# Altium schematic sheet LUCRARE_LICENTA.SchDoc
size A3; SheetNumber: 1; SheetTotal: 1
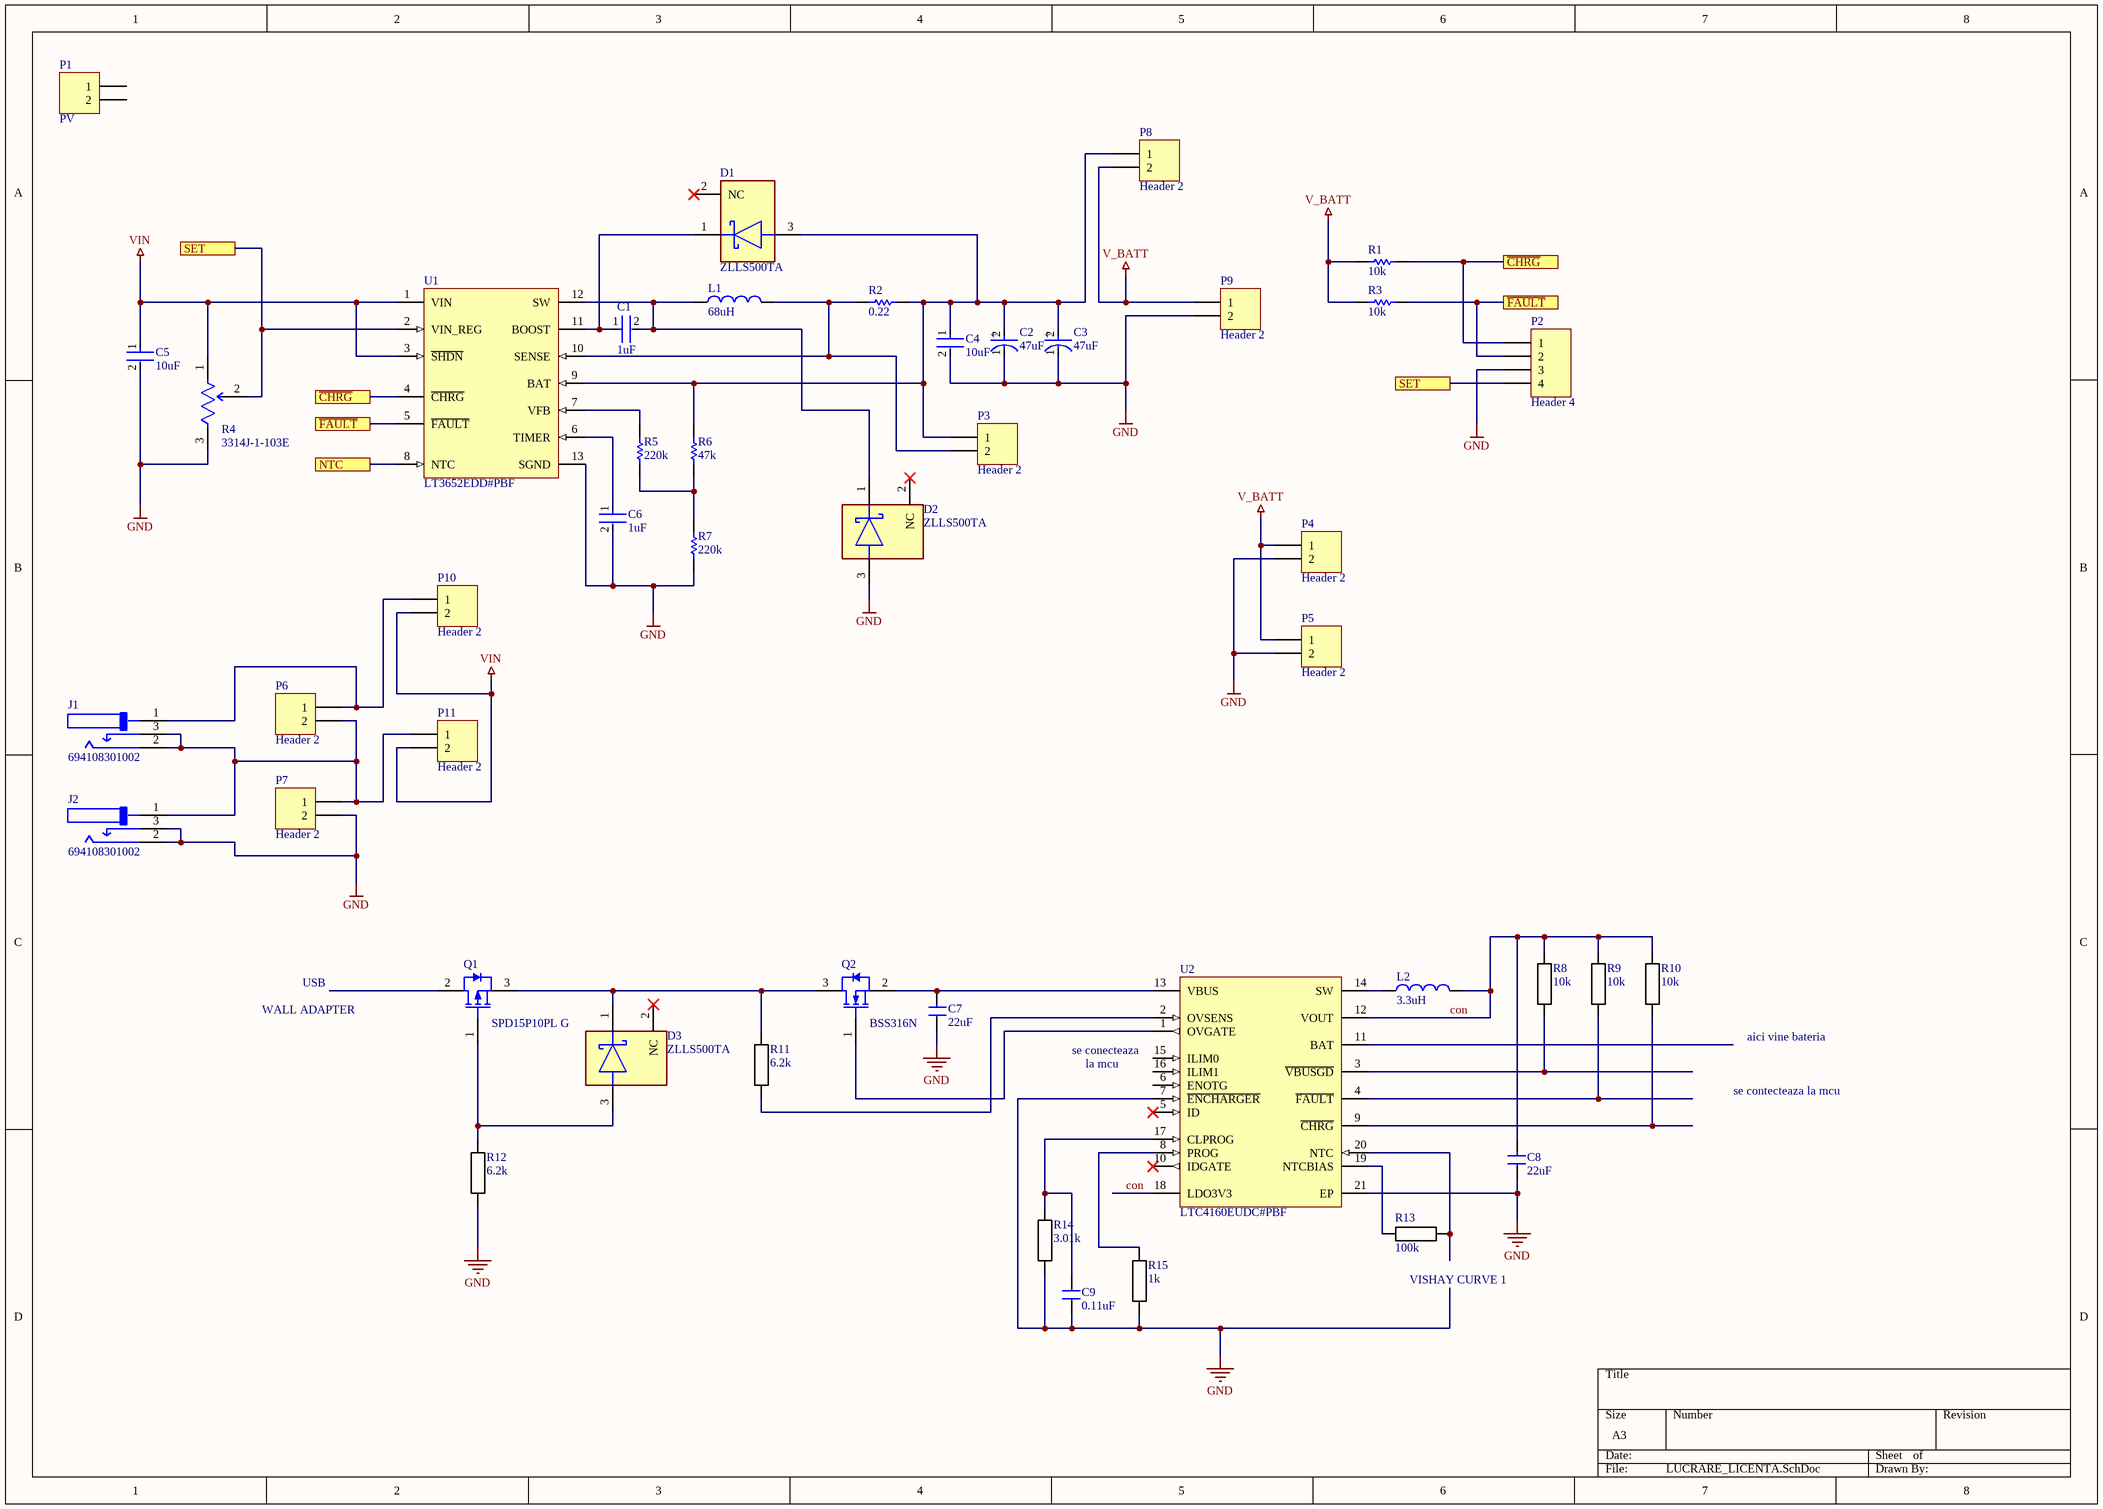
[diagram p0: LUCRARE_LICENTA.SchDoc]

## Parts
C1  1uF  [FP-0603-L_1_6_0_15-W_0_8-IPC_C]
C2  47uF  [FP-T491A476M006AT-MFG]
C3  47uF  [FP-T491A476M006AT-MFG]
C4  10uF  [FP-0603-L_1_6_0_15-W_0_8-MFG]
C5  10uF  [FP-0603-L_1_6_0_15-W_0_8-MFG]
C6  1uF  [FP-0603-L_1_6_0_15-W_0_8-IPC_C]
C7  22uF
C8  22uF
C9  0.11uF
D1  ZLLS500TA  [FP-SOT23-IPC_B]
D2  ZLLS500TA  [FP-SOT23-IPC_B]
D3  ZLLS500TA  [FP-SOT23-IPC_B]
J1  694108301002  [FP-694108301002-MFG]
J2  694108301002  [FP-694108301002-MFG]
L1  68uH
L2  3.3uH
P1  PV  [HDR1X2]
P2  Header 4  [HDR1X4]
P3  Header 2  [HDR1X2]
P4  Header 2  [HDR1X2]
P5  Header 2  [HDR1X2]
P6  Header 2  [HDR1X2]
P7  Header 2  [HDR1X2]
P8  Header 2  [HDR1X2]
P9  Header 2  [HDR1X2]
P10  Header 2  [HDR1X2]
P11  Header 2  [HDR1X2]
Q1  SPD15P10PL G  [INF-PG-TO252-3-1_N]
Q2  BSS316N  [INF-PG-SOT23_L]
R1  10k  [RESC1609X55X30LL15T15]
R2  0.22  [RESC1608X55X30NL15T15]
R3  10k  [RESC1609X55X30LL15T15]
R4  3314J-1-103E  [FP-3314J-1-MFG]
R5  220k  [RESC1608X55X25ML10T15]
R6  47k  [RESC1608X55X30NL15T15]
R7  220k  [RESC1608X55X25ML10T15]
R8  10k
R9  10k
R10  10k
R11  6.2k
R12  6.2k
R13  100k
R14  3.01k
R15  1k
U1  LT3652EDD#PBF  [LT-DD-12_V]
U2  LTC4160EUDC#PBF  [LT-UDC-20_N]

## Ports
NTC, SET, ~{CHRG}, ~{FAULT}

## Nets
GND: C2.1(C) C3.1(C) C4.2 C5.2 C6.2 C7.2 C8.1 C9.1 D2.3(A) J2.2 J2.3 P2.3 P4.2 P5.2 P7.2 P9.2 R4.3(CW) R7.1 R12.20 R14.20 R15.20 U1.13(SGND) U2.7(~{ENCHARGER}) U2.21(EP)
V_BATT: P4.1 P5.1 P8.2 P9.1 R1.1 R3.1
VIN: C5.1 P10.2 P11.2 R4.1(CCW) U1.1(VIN) U1.3(~{SHDN})
~{CHRG}: P2.1 R1.2 U1.4(~{CHRG}) ; port ~{CHRG}
con: C8.2 L2.2 R8.21 R9.21 R10.21 U2.12(VOUT) U2.18(LDO3V3)
~{FAULT}: P2.2 R3.2 U1.5(~{FAULT}) ; port ~{FAULT}
NTC: U1.8(NTC) ; port NTC
SET: P2.4 R4.2(WIPER) U1.2(VIN_REG) ; port SET
NetC1_1: C1.1 D1.1(C) U1.11(BOOST)
NetC1_2: C1.2 D2.1(C) L1.1 U1.12(SW)
NetC2_2: C2.2(A) C3.2(A) C4.1 D1.3(A) P3.1 P8.1 R2.2 R6.2 U1.9(BAT)
NetC6_1: C6.1 U1.6(TIMER)
NetC7_1: C7.1 Q2.2(SOURCE) U2.13(VBUS)
NetC9_2: C9.2 R14.21 U2.17(CLPROG)
NetD3_1: D3.1(C) Q1.3(SOURCE) Q2.3(DRAIN) R11.21
NetD3_3: D3.3(A) Q1.1(GATE) R12.21
NetJ1_1: J1.1 P6.1 P10.1
NetJ1_2: J1.2 J1.3 J2.1 P6.2 P7.1 P11.1
NetL1_2: L1.2 P3.2 R2.1 U1.10(SENSE)
NetL2_1: L2.1 U2.14(SW)
NetQ2_1: Q2.1(GATE) U2.1(OVGATE)
NetR5_1: R5.1 R6.1 R7.2
NetR5_2: R5.2 U1.7(VFB)
NetR8_20: R8.20 U2.3(~{VBUSGD})
NetR9_20: R9.20 U2.4(~{FAULT})
NetR10_20: R10.20 U2.9(~{CHRG})
NetR11_20: R11.20 U2.2(OVSENS)
NetR13_20: R13.20 U2.20(NTC)
NetR13_21: R13.21 U2.19(NTCBIAS)
NetR15_21: R15.21 U2.8(PROG)

Not connected (* = marked no-connect by the designer): D1 2(NC)*; D2 2(NC)*; D3 2(NC)*; P1 1 2; Q1 2(DRAIN); U2 5(ID)* 6(ENOTG) 10(IDGATE)* 11(BAT) 15(ILIM0) 16(ILIM1)

## Notes on the sheet
- USB
- WALL ADAPTER
- (near U2) se conecteaza
- aici vine bateria
- la mcu
- se contecteaza la mcu
- (near R13) VISHAY CURVE 1
- (in symbol CMP-2000-07189-2) +

## Library data of the parts
C1 C6 = CMP-2000-07531-4: Ceramic Capacitor General Use 1uF ±10% 50V X7R 0603; Series: M; Width: 0.031inch; Mount: Surface Mount; Radiation Hardening: No; Voltage Rating (DC): 50V; Packaging: Tape and Reel; Termination: SMD/SMT; Depth: 0.8mm; Case Code (Metric): 1608; Case Code (Imperial): 0603; Height: 0.8mm; Voltage Rating: 50V; Package Quantity: 1; Halogen Free: Halogen Free; Dielectric: X7R; Min Operating Temperature: -55°C; Length: 1.6mm; Construction: Flat; Tolerance: 10%; Thickness: 0.037inch; Max Operating Temperature: 125°C; Case/Package: 0603; Capacitance: 1uF; RoHS Compliant: Yes
C2 C3 = CMP-2000-07189-2: CAP TANT 47UF 20% 6.3V 1206; Voltage Rating (DC): 6V; ESR (Equivalent Series Resistance): 3.5R; Ripple Current: 146mA; Dissipation Factor: 12%; Dielectric Material: Tantalum; Life (Hours): 2000Hour; Leakage Current: 3uA; Polarity: Polar; Height - Seated (Max): 0.071inch; Case Code (Metric): 3216; Depth: 1.6mm; Case/Package: 1206; Termination: SMD/SMT; Number of Pins: 2; Max Operating Temperature: 125°C; Lead Free: Lead Free; Package Quantity: 1; Radiation Hardening: No; REACH SVHC: No SVHC; Features: General Purpose; Voltage: 6.3V; Width: 1.6mm; Mount: Surface Mount; Voltage Rating: 6.3V; Construction: Flat; Capacitance: 47uF; Height: 1.6mm; Tolerance: 20%; Series: T491; Length: 3.2mm; RoHS Compliant: Yes; Packaging: Tape and Reel; Case Code (Imperial): 1206; Min Operating Temperature: -55°C
C4 C5 = CMP-14477-000812-2: None; Tolerance: 20%; Voltage: 6.3V; Dielectric: X5R; Height: 0.8mm; Capacitance: 10uF; Depth: 0.8mm; Max Operating Temperature: 85°C; Packaging: Tape and Reel; Length: 1.6mm; Voltage Rating: 6.3V; Mount: Surface Mount; Case/Package: 0603; Termination: Wraparound; Min Operating Temperature: -55°C; Width: 0.031inch; RoHS Compliant: Yes; Thickness: 0.037inch
C7 C8 = CAP 22uF
C9 = CAP 0.1uF
D1-D3 = CMP-12790-000060-1: DIODE SCHOTTKY 40V 700MA SOT23-3; Max Forward Surge Current (Ifsm): 3.2A; Polarity: Standard; Peak Reverse Current: 10uA; Forward Voltage: 800mV; Peak Non-Repetitive Surge Current: 13A; Capacitance: 16pF; Power Dissipation: 500mW; Element Configuration: Single; Reverse Recovery Time: 3ns; Max Reverse Voltage (DC): 40V; Min Operating Temperature: -55°C; Height: 1mm; Termination: SMD/SMT; Forward Current: 700mA; Current Rating: 700mA; Max Operating Temperature: 150°C; Case/Package: SOT-23; Output Current: 700mA; Lead Free: Lead Free; Radiation Hardening: No; Mount: Surface Mount; Weight: 0.000282oz; Package Quantity: 3000; Width: 1.4mm; Packaging: Tape and Reel; Length: 3.05mm; Average Rectified Current: 700mA; Number of Pins: 3; Max Repetitive Reverse Voltage (Vrrm): 40V; Voltage Rating (DC): 40V
J1 J2 = CMP-1502-00190-2: CONN PWR JACK 2.5X5.5MM SOLDER; Pin Diameter: 2.5mm; Body Color: Black; Gender: Male; Voltage Rating (DC): 20V; Connector Type: Power; Current Rating: 5A; Shielding: Unshielded; Voltage Rating: 24V; Insulation Resistance: 100MR; RoHS Compliant: Yes; Packaging: Bulk; Mount: Through Hole; Max Operating Temperature: 85°C; Series: WR-DC; Contact Gender: Female; Termination: Through Hole; Flammability Rating: UL94 V-0; Package Quantity: 500; Color: Black; Contact Plating: Tin; Housing Material: Polyamide; Min Operating Temperature: -40°C; Contact Material: Copper Alloy
L1 = INDUCTOR 68uH
L2 = INDUCTOR 3.3uH
P1 P3-P11 = Header 2: Header, 2-Pin; LatestRevisionDate: 17-Jul-2002; LatestRevisionNote: Re-released for DXP Platform.; Publisher: Altium Limited
P2 = Header 4: Header, 4-Pin; LatestRevisionDate: 17-Jul-2002; LatestRevisionNote: Re-released for DXP Platform.; Publisher: Altium Limited
Q1 = CMP-1099-00052-1: P-Channel SIPMOS Power-Transistor, -100 V VDS, -15 A ID, -55 to 175 degC, PG-TO252-3-1, Reel, Green; Manufacturer: Infineon; Pto t (max): 128Â W; RDS (on) (max): 200Â mOhm; ID (max): -15Â A; VDS (max): -100Â V; RDS (on) (max) (@4.5V): 270Â mOhm; IDpuls (max): -60Â A; VGS(th) (max): -2Â V; QG: 47Â nC; Mode: Enhancement; Rth: 1.17Â K/W; VGS(th) (min): -1Â V; Polarity: P; Green: TRUE; PackageReference: PG-TO252-3-1; Mounting Technology: Surface Mount; ComponentLink1Description: Manufacturer URL; ComponentLink3Description: Package Specification; DatasheetVersion: Rev. 1.5; ComponentLink2Description: Datasheet; PackageDescription: 3-Pin Plastic (Green) Transistor Single Outline Package, 6.5 x 6.12 mm Body, 2.28 mm Pitch; Technology: SIPMOS; ComponentLink2URL: http://www.infineon.com/dgdl/SPD15P10PL%2BG_Rev1.5.pdf?folderId=db3a304314dca38901154a72e3951a65&fileId=db3a30433c1a8752013c39ff5f2e4af3; ComponentLink3URL: http://www.infineon.com/dgdl/TLE42744_DS_11.pdf?folderId=db3a304318f3fe290118f5a433570040&fileId=db3a304327b897500128012ccafe37d2&sId=db3a30443d67b5ca013d83f7c0ea327b; Packing: Reel; ComponentLink1URL: http://www.infineon.com/; PackageVersion: Jan-10; PartNumber: SPD15P10PL G
Q2 = CMP-1149-00034-1: N-Channel OptiMOS 2 Small-Signal-Transistor, 30 V VDS, 1.4 A ID, -55 to 150 degC, PG-SOT23, Reel, Green; Manufacturer: Infineon; VDS (max): 30 V; RDS (on) (max): 160 mOhm; ID (max): 1.4Â A; Ptot (max): 0.5Â W; RDS (on) (max) (@4.5V): 280 mOhm; VGS(th) (min): 1.2Â V; QG: 0.6Â nC; Green: TRUE; VGS(th) (max): 2 V; IDpuls (max): 5.6Â A; RthJA (max): 250 K/W; ComponentLink2URL: http://www.infineon.com/dgdl/BSS316N_Rev2.3.pdf?folderId=db3a3043156fd573011622e10b5c1f67&fileId=db3a304330f686060130ff7ee4b07f16; Mounting Technology: Surface Mount; Halogen-free: TRUE; ComponentLink3Description: Package Specification; DatasheetVersion: Rev. 2.3; PackageReference: PG-SOT23; PartNumber: BSS316N; ComponentLink1Description: Manufacturer URL; ComponentLink1URL: http://www.infineon.com/; ComponentLink2Description: Datasheet; PackageVersion: Apr-08; ComponentLink3URL: http://www.infineon.com/dgdl/SOT23-Package_Overview.pdf?folderId=db3a30431936bc4b0119532290053c66&fileId=db3a30431936bc4b0119533468123c85; Packing: Reel; PackageDescription: 3-Pin Small Outline Transistor Package, 2.9 x 1.3 mm Body, 0.95 mm Pitch
R1 R3 = CMP-1012-00623-3: Chip Resistor, 10 KOhm, +/- 1%, 0.1 W, -55 to 155 degC, 0603 (1608 Metric), RoHS, Tape and Reel; Manufacturer: Panasonic; Voltage Rating: 75V; Case\/Package: 0603; Power Rating: 100mW; Resistance: 10KOhm; Temperature Coefficient: 100ppm\/degreesC; Number of Pins: 2; Package Reference: 603; Depth: 0.8mm; Mount: SurfaceMount; Package Description: 2-Pin Surface Mount Device, Body 1.6 x 0.85 mm; Datasheet Version: 02/2017; Length: 1.6mm; Lead Free: LeadFree; Height: 0.45mm; Number of Terminations: 2; Max Power Dissipation: 100mW; Min Operating Temperature: -55degC; Datasheet URL: https://industrial.panasonic.com/cdbs/www-data/pdf/RDA0000/AOA0000C304.pdf; Termination: SMD/SMT; Case Code (Metric): 1608; Case Code (Imperial): 0603; Tolerance: 1%; Max Operating Temperature: 155degC; RoHSCompliant: true; Voltage Rating (DC): 75V; Radiation Hardening: No; Packaging: TapeandReel; Composition: ThickFilm; Mounting Technology: SurfaceMount; Manufacturer URL: http://www.panasonic.com/; Width: 0.031inch; REACH SVHC: NoSVHC; Contact Plating: Tin; Military Standard: Not; Package Quantity: 1
R2 = CMP-2000-00853-1: Part Number: ERJ-3RQFR22V; Manufacturer: Panasonic
R4 = CMP-07234-000035-1: TRIMMER 10K OHM 0.25W J LEAD TOP; RoHS Compliant: Yes
R5 R7 = CMP-1659-00037-1: Chip Resistor, 220 KOhm, +/- 1%, 100 mW, -55 to 155 degC, 0603 (1608 Metric), RoHS, Tape and Reel; Resistance: 0.1 Ohm; ComponentLink1Description: Manufacturer URL; ComponentLink2Description: Datasheet; ComponentLink1URL: http://www.yageo.com/; REACH SVHC: No SVHC; RoHSCompliant: true; DatasheetVersion: Rev. 4, 02/2016; Min Operating Temperature: -25 degC; Height: 0.25 inch; ComponentLink2URL: http://www.yageo.com/documents/recent/PYu-RC_Group_51_RoHS_L_04.pdf; PackageDescription: 2-Pin Surface Mount Device, Body 1.6 x 0.8 mm; Max Operating Temperature: 70 degC; Width: 0.25 inch; Length: 0.75 inch; PackageReference: 0603
R6 = CMP-2000-00523-2: Chip Resistor, 47 KOhm, +/- 1%, 0.1 W, -55 to 155 degC, 0603 (1608 Metric), RoHS, Tape and Reel; Case\Package: 0603; Forward Current: 20 mA; Power Rating: 90 mW; Illumination Colour: Red; Nominal Vf: 2.1 V; Viewing Angle: 160 degrees; Luminous Intensity: 63 mcd; Lens Style: Clear; Nominal Wavelength: 639 nm; Case Code (Imperial): 0603; Case Code (Metric): 1608; Packaging: Tape and Reel; Radiation Hardening: No; Colour: Red; PackageDescription: 2-Pin Surface Mount Device, Body 1.6 x 0.85 mm; ComponentLink1Description: Manufacturer URL; Width: 0.8 mm; DatasheetVersion: Apr-15; ComponentLink2URL: http://industrial.panasonic.com/cdbs/www-data/pdf/RDA0000/AOA0000C86.pdf; Min Operating Temperature: -40 degC; Height: 0.6 mm; Package Quantity: 3000; ComponentLink2Description: Datasheet; REACH SVHC: No SVHC; ComponentLink1URL: http://www.panasonic.com/; Mount: Surface Mount; RoHSCompliant: true; Max Operating Temperature: 100 degC; PackageReference: 0603; Length: 1.6 mm; Forward Voltage: 2.1 V; Pins: 2
R8-R10 = RS 10k
R11 R12 = RS 6.2k
R13 = RS 100k
R14 = RS 3.01k
R15 = RS 1k
U1 = CMP-0473-00061-1: Power Tracking 2 A Battery Charger for Solar Power, 12-pin SON (DD-12), -40 to 125 degC, Pb-Free; Manufacturer: Linear Technology; Vin Max(V): 32; Vin Min(V): 4.95; Number of Outputs: 1; PartNumber: LT3652EDD#PBF; ComponentLink3Description: Package Specification; Mounting Technology: Surface Mount; ComponentLink1Description: Manufacturer URL; Topology: Battery Charger; ComponentLink2Description: Datasheet; PackageDescription: 12-Pin Plastic DFN, Body 3 x 3 mm, Pitch 0.45 mm; ComponentLink1URL: http://www.linear.com/; PackageVersion: Rev. A, 06/2010; PackageReference: DD-12; ComponentLink3URL: http://cds.linear.com/docs/en/packaging/DFN_12_05-08-1725.pdf; DatasheetVersion: Rev. D; Energy Source: Solar; ComponentLink2URL: http://cds.linear.com/docs/en/datasheet/3652fd.pdf; RoHS: TRUE
U2 = CMP-0478-00217-1: Switching Power Manager with USB On-The-Go And Overvoltage Protection, 4.35 to 5.5 V Vin, 20-pin QFN (UDC-20), -40 to 85 degC, Pb-Free; Manufacturer: Linear Technology; Number of Outputs: 1; Vin Min(V): 4.35; Vin Max(V): 5.5; ComponentLink2URL: http://cds.linear.com/docs/en/datasheet/41601fa.pdf; PackageDescription: 20-Pin Plastic QFN, Body 3 x 4 mm, Pitch 0.5 mm; PartNumber: LTC4160EUDC#PBF; DatasheetVersion: Rev. A; ComponentLink3URL: http://cds.linear.com/docs/en/packaging/QFN_20_05-08-1742.pdf; PackageReference: UDC20; RoHS: TRUE; Mounting Technology: Surface Mount; ComponentLink1URL: http://www.linear.com/; ComponentLink1Description: Manufacturer URL; PackageVersion: Rev. Ã˜, 06/2010; ComponentLink2Description: Datasheet; Number of Cells: 1; ComponentLink3Description: Package Specification